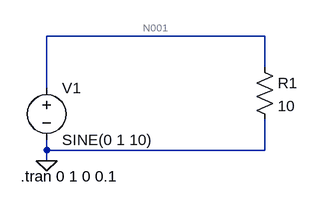
[diagram p0: schematic L1_C1.asc]
L1_C1.asc, the LTspice schematic file:
Version 4
SHEET 1 880 680
WIRE 384 48 48 48
WIRE 384 96 384 48
WIRE 48 128 48 48
WIRE 48 224 48 208
WIRE 384 224 384 176
WIRE 384 224 48 224
WIRE 48 240 48 224
FLAG 48 240 0
SYMBOL voltage 48 112 R0
WINDOW 123 0 0 Left 0
WINDOW 39 0 0 Left 0
SYMATTR InstName V1
SYMATTR Value SINE(0 1 10)
SYMBOL res 368 80 R0
SYMATTR InstName R1
SYMATTR Value 10
TEXT 8 264 Left 2 !.tran 0 1 0 0.1

The netlist it stands for:
* L1_C1.asc
V1 N001 0 SINE(0 1 10)
R1 N001 0 10
.tran 0 1 0 0.1
.backanno
.end

* Results of the author's LTspice run, read from the files saved beside the schematic
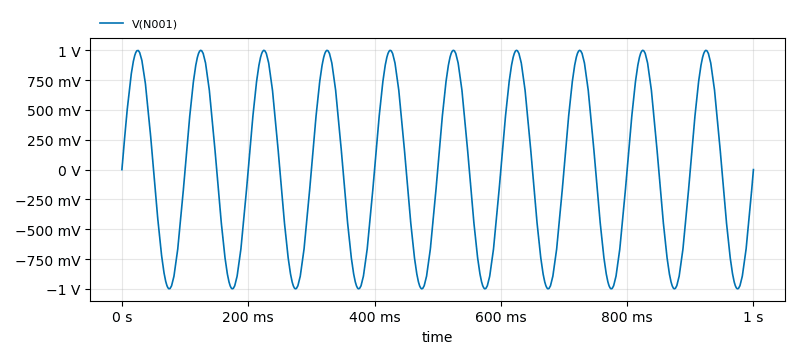
[diagram p1: Transient Analysis of L1_C1.asc, plotted from the saved traces]
* Transient Analysis, 1 run:
*   V(N001): min -999.5 mV, max 999.5 mV, average 29.87 µV, rms 718.5 mV, last 0 V